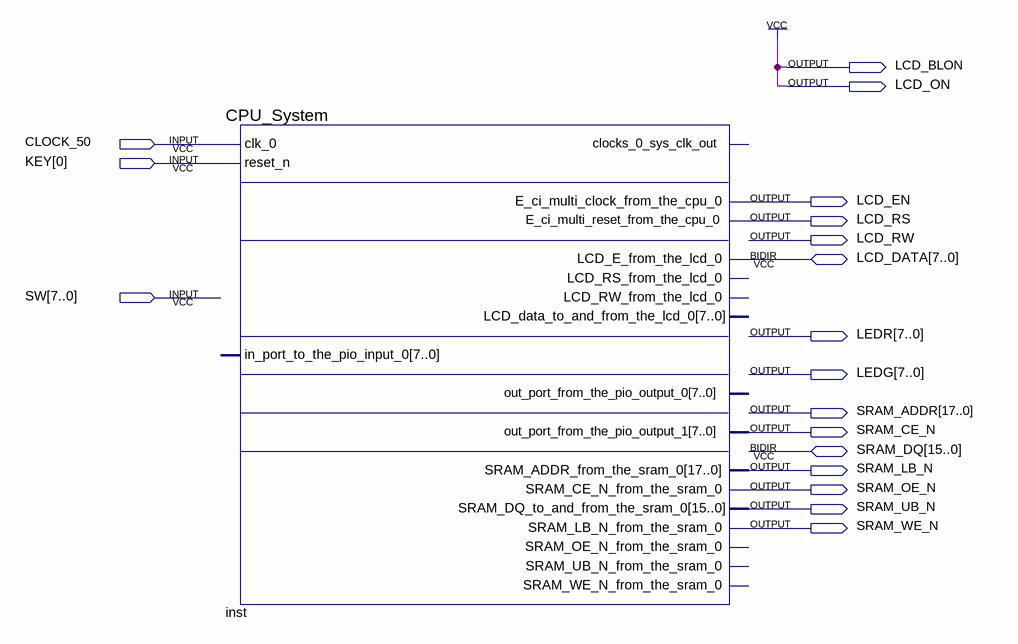
[diagram p0: schematic sheet]
// Quartus schematic MyFirstSopc_Top.bdf as structural Verilog: 1 symbols, 18 pins
module MyFirstSopc_Top (
  input  CLOCK_50,
  input  [0:0] KEY,
  input  [7:0] SW,
  inout  [7:0] LCD_DATA,
  inout  [15:0] SRAM_DQ,
  output LCD_BLON,
  output LCD_ON,
  output LCD_EN,
  output LCD_RS,
  output LCD_RW,
  output [7:0] LEDR,
  output [7:0] LEDG,
  output [17:0] SRAM_ADDR,
  output SRAM_CE_N,
  output SRAM_LB_N,
  output SRAM_OE_N,
  output SRAM_UB_N,
  output SRAM_WE_N
);

  CPU_System inst (
    .clk_0(CLOCK_50), .reset_n(KEY[0]), .E_ci_multi_clock_from_the_cpu_0(LCD_EN),
    .E_ci_multi_reset_from_the_cpu_0(LCD_RS), .LCD_E_from_the_lcd_0(LCD_DATA),
    .out_port_from_the_pio_output_1(SRAM_CE_N), .SRAM_ADDR_from_the_sram_0(SRAM_LB_N),
    .SRAM_CE_N_from_the_sram_0(SRAM_OE_N), .SRAM_LB_N_from_the_sram_0(SRAM_WE_N),
    .SRAM_DQ_to_and_from_the_sram_0(SRAM_UB_N));  // open: in_port_to_the_pio_input_0, clocks_0_sys_clk_out, LCD_RS_from_the_lcd_0, LCD_RW_from_the_lcd_0, out_port_from_the_pio_output_0, SRAM_OE_N_from_the_sram_0, SRAM_UB_N_from_the_sram_0, SRAM_WE_N_from_the_sram_0, LCD_data_to_and_from_the_lcd_0

  assign LCD_BLON = 1'b1;
  assign LCD_ON = 1'b1;
endmodule
